# EAGLE design 6packRev1A (EAGLE 8.5.2)
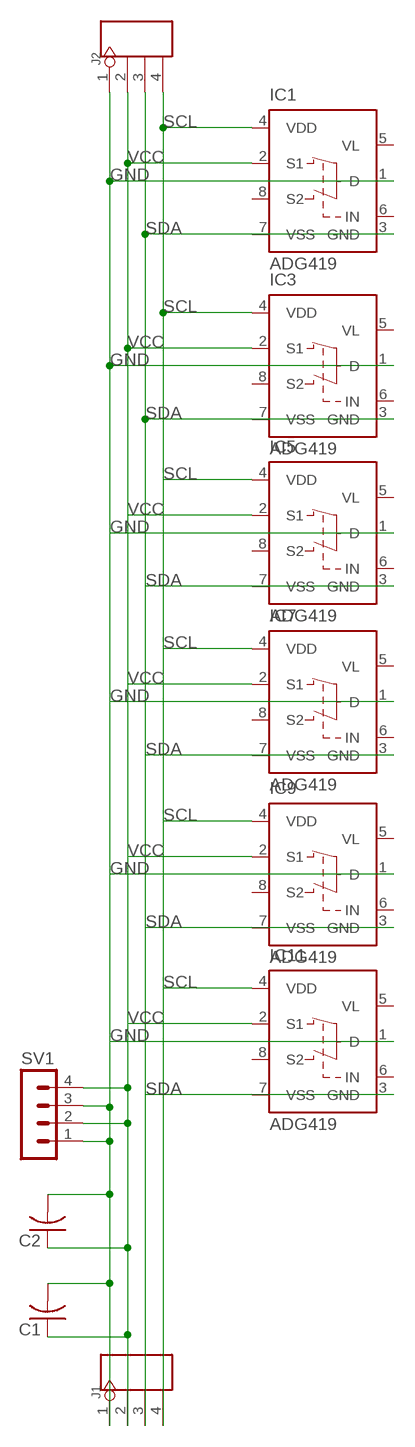
[diagram p0: schematic, sheet 1]

## Parts
C1  C-USC0805  [C0805]
C2  C-USC0805  [C0805]
IC1  ADG419  [DIL08]
IC3  ADG419  [DIL08]
IC5  ADG419  [DIL08]
IC7  ADG419  [DIL08]
IC9  ADG419  [DIL08]
IC11  ADG419  [DIL08]
J1  HEADER-4P-80/40MIL  [4P-2.54-80/40MIL]
J2  HEADER-4P-80/40MIL  [4P-2.54-80/40MIL]
SV1  MA04-1  [MA04-1]

## Nets
GND: C1.2 C2.2 IC1.1(D) IC3.1(D) IC5.1(D) IC7.1(D) IC9.1(D) IC11.1(D) J1.1 J2.1 SV1.1 SV1.3
SCL: IC1.4(VDD) IC3.4(VDD) IC5.4(VDD) IC7.4(VDD) IC9.4(VDD) IC11.4(VDD) J1.4 J2.4
SDA: IC1.3(GND) IC1.7(VSS) IC3.3(GND) IC3.7(VSS) IC5.3(GND) IC5.7(VSS) IC7.3(GND) IC7.7(VSS) IC9.3(GND) IC11.3(GND) J1.3 J2.3
VCC: C1.1 C2.1 IC1.2(S1) IC3.2(S1) IC5.2(S1) IC7.2(S1) IC9.2(S1) IC11.2(S1) J1.2 J2.2 SV1.2 SV1.4
Unconnected: IC1.6(IN) IC1.8(S2) IC3.6(IN) IC3.8(S2) IC5.6(IN) IC5.8(S2) IC7.6(IN) IC7.8(S2) IC9.6(IN) IC9.8(S2) IC11.6(IN) IC11.8(S2)

## Power pins joined to a net without a drawn wire
VL: IC1.5(VL) IC3.5(VL) IC5.5(VL) IC7.5(VL) IC9.5(VL) IC11.5(VL)
VSS: IC9.7(VSS) IC11.7(VSS)

## Library data of the parts
C1 C2 = rcl:C-US: CAPACITOR, American symbol
IC1 IC3 IC5 IC7 IC9 IC11 = analog-devices:ADG419: LC²MOS Precision Mini-DIP Analog switch Source: http://www.analog.com/UploadedFiles/Data_Sheets/ADG419.pdf; MF: ALTERA CORPORATION; MPN: ADG419BN; OC_FARNELL: 1438705; OC_NEWARK: 16F6524
J1 J2 = Connector:HEADER-4P
SV1 = con-lstb:MA04-1: PIN HEADER; OC_FARNELL: unknown; OC_NEWARK: unknown

## Board
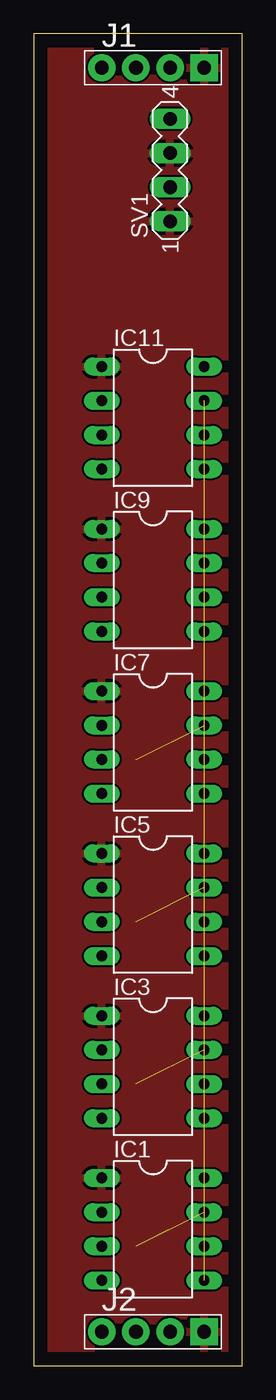
[diagram p1: board, top side]
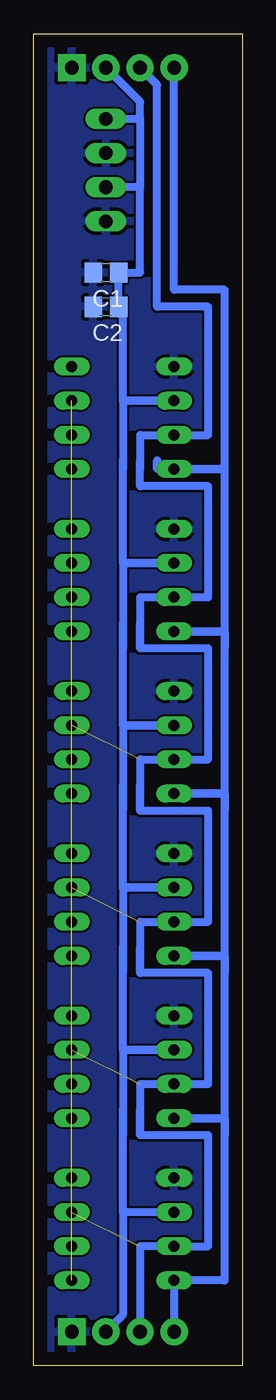
[diagram p2: board, bottom side, seen from below]

Size 15.54 x 99.05 mm. Coordinates in mm from the lower left corner, seen from the top.
Outline: 0,0 15.54,0 15.54,99.05 0,99.05 0,0
Copper layers (1*16): Top 0.035mm / dielectric 1.5mm / Bottom 0.035mm
Design rules "default": minimum track width 6mil, minimum drill 0.35mm, track to track 6mil, track to pad 6mil, pad to pad 6mil, via to via 6mil, smd to smd 6mil, copper to edge 40mil, drill to drill 6mil, minimum pad ring 10mil, minimum via ring 8mil, stop-mask expansion 4mil, vias tented up to drill 0mil, thermal gap 10mil

### Footprints (pad centres in the part's own frame; a part is rotated, then mirrored left to right if it is on the bottom)
C0805 = smd 1.3 x 1.5: 1 -0.95,0; 2 0.95,0
DIL08 = drill 0.813 long: 1 -3.81,-3.81; 2 -1.27,-3.81; 3 1.27,-3.81; 4 3.81,-3.81; 5 3.81,3.81; 6 1.27,3.81; 7 -1.27,3.81; 8 -3.81,3.81
4P-2.54-80/40MIL = drill 1.016 pad 2.032 square: 1 0,3.81 | drill 1.016 pad 2.032: 2 0,1.27; 3 0,-1.27; 4 0,-3.81
MA04-1 = drill 1.016 long: 1 -3.81,0; 2 -1.27,0; 3 1.27,0; 4 3.81,0

### Placement (x,y rotation side)
C1  10.16,81.28 180 bottom
C2  10.16,78.74 180 bottom
IC1  8.89,10.16 270 top
IC3  8.89,22.23 270 top
IC5  8.89,34.29 270 top
IC7  8.89,46.35 270 top
IC9  8.89,58.42 270 top
IC11  8.89,70.48 270 top
J1  8.89,96.52 270 top
J2  8.89,2.54 270 top
SV1  10.16,88.9 90 top

### Tracks (layer width: path | path; a pad name or v marks a point on that pad's centre or on a via)
GND
  Bottom 0.61: C1.2 11.43,81.28
  pour Top: 15.24,0 0,0 0,99.06 15.24,99.06
  pour Bottom: 0,0 15.24,0 15.24,99.06 0,99.06
SCL
  Bottom 0.61: 1.32,18.41 1.32,6.35 IC1.4 J2.4 | 1.32,18.41 IC3.4 1.32,18.41 | 1.32,18.41 1.32,29.21 | 1.32,29.21 1.32,30.48 | 1.32,30.48 IC5.4 1.32,30.48 | 1.32,18.41 1.32,17.14 | 1.32,30.48 1.32,42.55 | 1.32,42.55 IC7.4 1.32,42.55 | 1.32,30.48 1.32,29.21 | 1.32,42.55 1.32,54.61 | 1.32,54.61 IC9.4 1.32,54.61 | 1.32,42.55 1.32,41.27 | 1.32,54.61 1.32,66.67 | 1.32,66.67 6.35,66.67 6.35,67.31 | 1.32,54.61 1.32,53.34 | IC11.4 1.32,66.67 | 1.32,66.67 1.32,80.01 5.08,80.01 J1.4
SDA  (4 unrouted)
  Bottom 0.61: 7.62,17.14 2.54,17.14 2.54,8.89 IC1.3 7.62,8.89 J2.3 | 7.62,17.14 7.62,19.05 | 7.62,17.14 7.62,20.95 IC3.3 2.54,20.95 2.54,29.21 7.62,29.21 | 7.62,29.21 7.62,31.11 | 7.62,29.21 7.62,33.02 IC5.3 2.54,33.02 2.54,41.27 7.62,41.27 | 7.62,41.27 7.62,43.18 | 7.62,41.27 7.62,45.09 IC7.3 2.54,45.09 2.54,53.34 7.62,53.34 | 7.62,53.34 7.62,55.24 | 7.62,53.34 7.62,57.15 IC9.3 2.54,57.15 2.54,65.41 7.62,65.41 7.62,66.67 | 7.62,66.67 7.62,67.31 | 7.62,66.67 7.62,69.22 IC11.3 2.54,69.22 2.54,78.74 6.35,78.74 6.35,95.25 J1.3
VCC
  Bottom 0.61: 8.89,11.43 IC1.2 8.89,11.43 | 8.89,11.43 8.89,15.88 8.89,17.14 | 8.89,17.14 8.89,19.05 | 8.89,23.5 IC3.2 8.89,23.5 | 8.89,23.5 8.89,17.14 | 8.89,23.5 8.89,27.94 8.89,29.21 | 8.89,29.21 8.89,31.11 | 8.89,35.56 IC5.2 8.89,35.56 | 8.89,35.56 8.89,29.21 | 8.89,35.56 8.89,40.01 8.89,41.27 | 8.89,41.27 8.89,43.18 | 8.89,47.62 IC7.2 8.89,47.62 | 8.89,47.62 8.89,41.27 | 8.89,47.62 8.89,52.07 8.89,53.34 | 8.89,53.34 8.89,55.24 | 8.89,59.69 IC9.2 8.89,59.69 | 8.89,59.69 8.89,53.34 | 8.89,59.69 8.89,64.14 8.89,66.67 | 8.89,66.67 8.89,67.31 | 8.89,71.75 IC11.2 8.89,71.75 | 8.89,71.75 8.89,66.67 | 8.89,71.75 8.89,77.47 8.89,78.42 C2.1 C1.1 | C1.1 8.89,81.28 | C1.1 7.62,81.28 7.62,87.63 | 7.62,87.63 SV1.2 | 7.62,92.71 7.62,87.63 | 7.62,92.71 7.62,93.98 J1.2 | SV1.4 7.62,92.71 | J2.2 8.89,3.81 8.89,11.43
VL  (5 unrouted)
VSS  (1 unrouted)